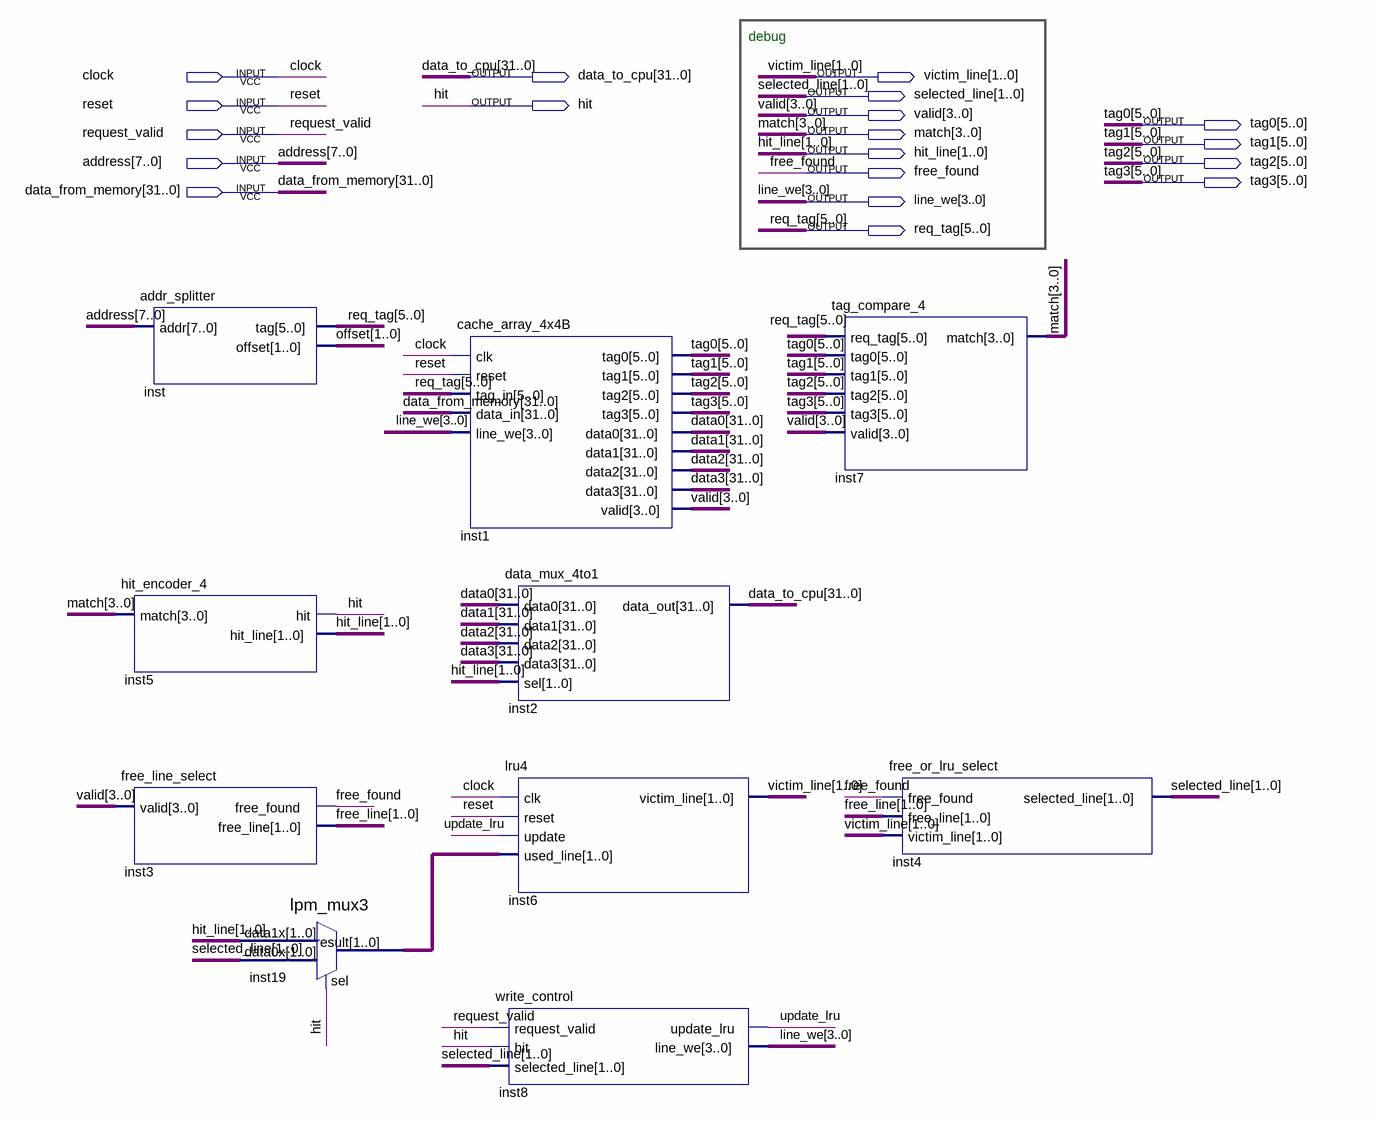
[diagram p0: schematic sheet]
// Quartus schematic top.bdf as structural Verilog: 10 symbols, 19 pins
module top (
  input  clock,
  input  reset,
  input  request_valid,
  input  [7:0] address,
  input  [31:0] data_from_memory,
  output [31:0] data_to_cpu,
  output [1:0] victim_line,
  output [1:0] selected_line,
  output hit,
  output [3:0] valid,
  output [5:0] tag0,
  output [3:0] match,
  output [5:0] tag1,
  output [1:0] hit_line,
  output [5:0] tag2,
  output free_found,
  output [5:0] tag3,
  output [3:0] line_we,
  output [5:0] req_tag
);

  wire update_lru;
  wire [1:0] free_line, inst19_result, offset;
  wire [31:0] data0, data1, data2, data3;

  addr_splitter inst (.addr(address), .tag(req_tag), .offset(offset));
  hit_encoder_4 inst5 (.match(match), .hit(hit), .hit_line(hit_line));
  free_line_select inst3 (.valid(valid), .free_found(free_found), .free_line(free_line));
  lpm_mux3 inst19 (.data1x(hit_line), .data0x(selected_line), .sel(hit), .result(inst19_result));
  cache_array_4x4B inst1 (
    .clk(clock), .reset(reset), .tag_in(req_tag), .data_in(data_from_memory), .line_we(line_we), .tag0(tag0),
    .tag1(tag1), .tag2(tag2), .tag3(tag3), .data0(data0), .data1(data1), .data2(data2), .data3(data3),
    .valid(valid));
  write_control inst8 (
    .request_valid(request_valid), .hit(hit), .selected_line(selected_line), .update_lru(update_lru),
    .line_we(line_we));
  data_mux_4to1 inst2 (
    .data0(data0), .data1(data1), .data2(data2), .data3(data3), .sel(hit_line), .data_out(data_to_cpu));
  lru4 inst6 (.clk(clock), .reset(reset), .update(update_lru), .used_line(inst19_result), .victim_line(victim_line));
  tag_compare_4 inst7 (
    .req_tag(req_tag), .tag0(tag0), .tag1(tag1), .tag2(tag2), .tag3(tag3), .valid(valid), .match(match));
  free_or_lru_select inst4 (
    .free_found(free_found), .free_line(free_line), .victim_line(victim_line), .selected_line(selected_line));

  // Notes on the sheet:
  //   debug
endmodule
